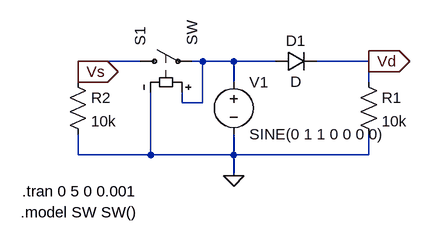
[diagram p0: schematic g2_p2.asc]
g2_p2.asc, the LTspice schematic file:
Version 4
SHEET 1 880 680
WIRE 0 96 -96 96
WIRE 96 96 80 96
WIRE 144 96 96 96
WIRE 208 96 144 96
WIRE 352 96 272 96
WIRE -96 112 -96 96
WIRE -96 128 -96 112
WIRE 144 128 144 96
WIRE 352 128 352 96
WIRE 64 160 64 144
WIRE 96 160 96 96
WIRE 96 160 64 160
WIRE -96 240 -96 208
WIRE 16 240 16 144
WIRE 16 240 -96 240
WIRE 144 240 144 208
WIRE 144 240 16 240
WIRE 352 240 352 208
WIRE 352 240 144 240
WIRE 144 272 144 240
FLAG 144 272 0
FLAG 352 96 Vd
IOPIN 352 96 Out
FLAG -96 112 Vs
IOPIN -96 112 Out
SYMBOL voltage 144 112 R0
WINDOW 123 0 0 Left 0
WINDOW 39 0 0 Left 0
SYMATTR InstName V1
SYMATTR Value SINE(0 1 1 0 0 0 0)
SYMBOL diode 208 112 R270
WINDOW 0 32 32 VTop 2
WINDOW 3 0 32 VBottom 2
SYMATTR InstName D1
SYMBOL res 336 112 R0
SYMATTR InstName R1
SYMATTR Value 10k
SYMBOL res -112 112 R0
SYMATTR InstName R2
SYMATTR Value 10k
SYMBOL sw -16 96 R270
SYMATTR InstName S1
TEXT -182 296 Left 2 !.tran 0 5 0 0.001
TEXT -184 328 Left 2 !.model SW SW()

The netlist it stands for:
* g2_p2.asc
V1 N001 0 SINE(0 1 1 0 0 0 0)
D1 N001 Vd D
R1 Vd 0 10k
R2 Vs 0 10k
S1 Vs N001 N001 0 SW
.model D D
.lib standard.dio
.tran 0 5 0 0.001
.model SW SW()
.backanno
.end